# Altium schematic sheet Sinalização.SchDoc
size A4
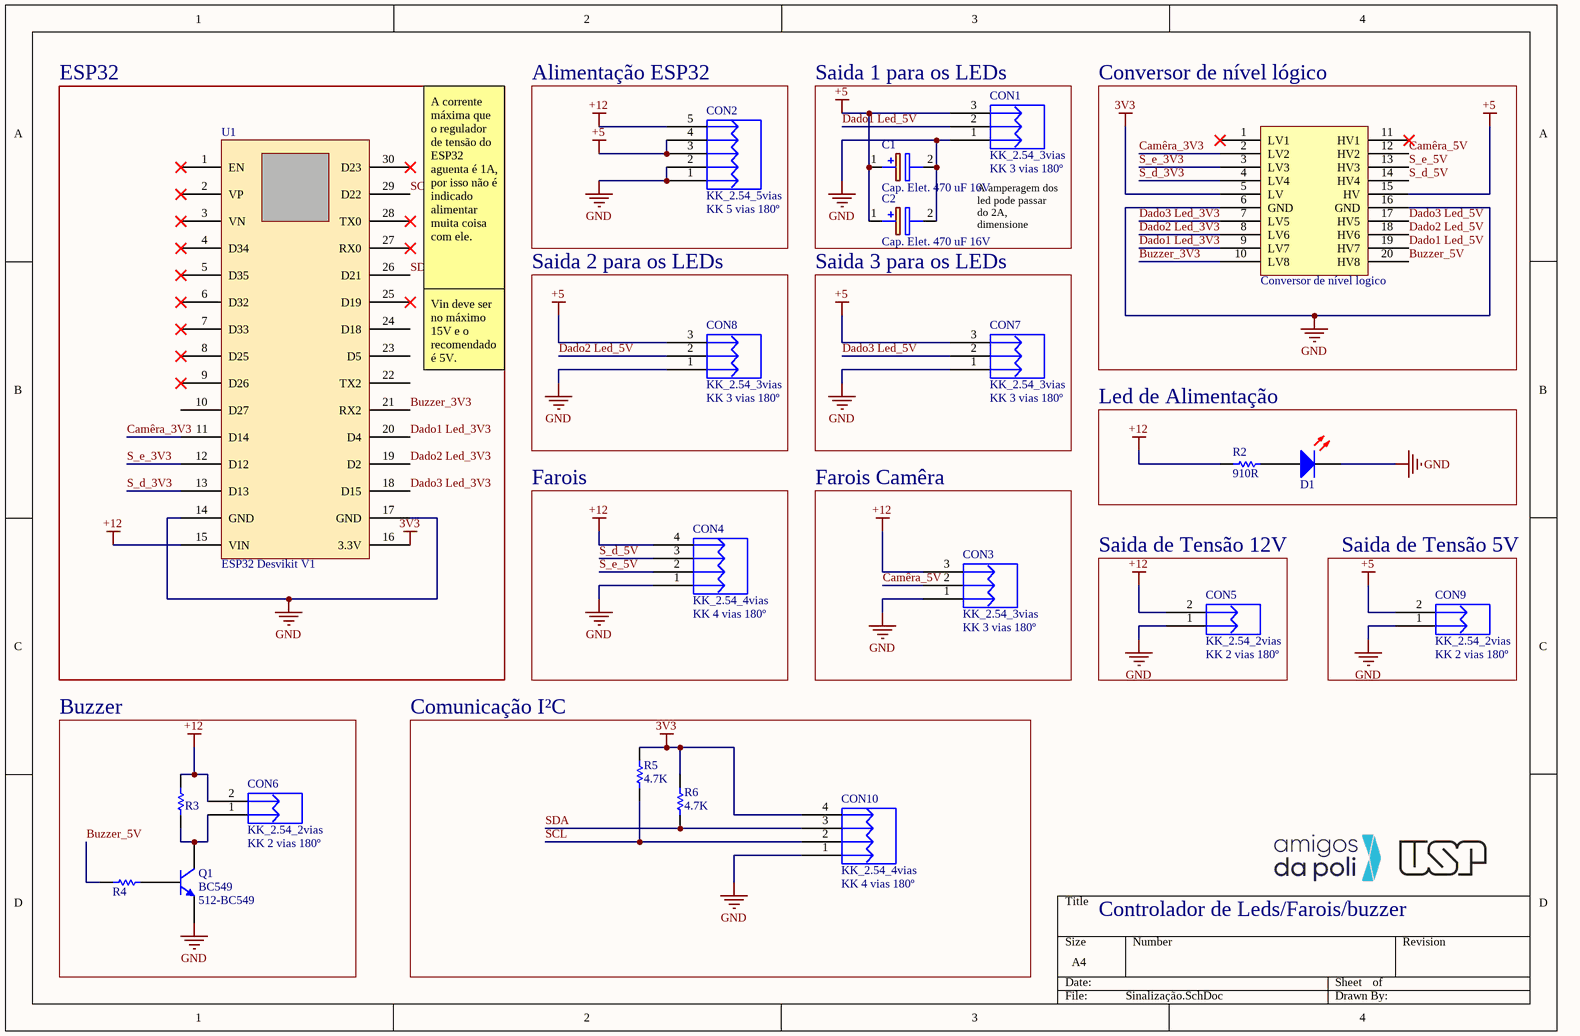
[diagram p0: Sinalização.SchDoc]

## Parts
?  Conversor de nível logico  [Conversor de nível lógico]
C1  Cap. Elet. 470 uF 16V  [Cap. Elet. 470uF 16V]
C2  Cap. Elet. 470 uF 16V  [Cap. Elet. 470uF 16V]
CON1  KK_2.54_3vias  Valor: KK 3 vias 180º  [KK_3vias_180º]
CON2  KK_2.54_5vias  Valor: KK 5 vias 180º  [KK_5vias_180°]
CON3  KK_2.54_3vias  Valor: KK 3 vias 180º  [KK_3vias_180º]
CON4  KK_2.54_4vias  Valor: KK 4 vias 180º  [KK_4vias_180°]
CON5  KK_2.54_2vias  Valor: KK 2 vias 180º  [KK_2VIAS_180º]
CON6  KK_2.54_2vias  Valor: KK 2 vias 180º  [KK_2VIAS_180º]
CON7  KK_2.54_3vias  Valor: KK 3 vias 180º  [KK_3vias_180º]
CON8  KK_2.54_3vias  Valor: KK 3 vias 180º  [KK_3vias_180º]
CON9  KK_2.54_2vias  Valor: KK 2 vias 180º  [KK_2VIAS_180º]
CON10  KK_2.54_4vias  Valor: KK 4 vias 180º  [KK_4vias_180°]
D1  LED 5MM RED  [LED 5MM RED]  (value not drawn)
Q1  BC549  Supplier Part Number 1: 512-BC549  [TO92]
R2  Resistance (Ohms): 910R  [RES 470R 1/4W CARBON FILM]  (hidden comment: RES 470R 1/4W CARBON FILM)
R3  RES 1/4W CARBON FILM  [RES 10K 1/4W CARBON FILM]  (value not drawn)
R4  RES 1/4W CARBON FILM  [RES 10K 1/4W CARBON FILM]  (value not drawn)
R5  4.7K  [RES 4.7K 1/4W CARBON FILM]
R6  4.7K  [RES 4.7K 1/4W CARBON FILM]
U1  value ESP32 Desvikit V1  [ESP32_Desvikit_v1]  (hidden comment: microcontrolador)

## Blocks framed on the sheet
ESP32: U1
Alimentação ESP32: CON2
Saida 1 para os LEDs: C1 C2 CON1
Conversor de nível lógico: ?
Saida 2 para os LEDs: CON8
Saida 3 para os LEDs: CON7
Led de Alimentação: D1 R2
Farois: CON4
Farois Camêra: CON3
Saida de Tensão 12V: CON5
Saida de Tensão 5V: CON9
Buzzer: CON6 Q1 R3 R4
Comunicação I²C: CON10 R5 R6

## Nets
3V3: ?.5(LV) CON10.4 R5.1 R6.1 U1.16(3.3V)
+5: ?.15(HV) C1.1(+) C2.1(+) CON1.3 CON2.3 CON2.4 CON7.3 CON8.3 CON9.2
+12: CON2.5 CON3.3 CON4.4 CON5.2 CON6.2 R2.2 R3.1 U1.15(VIN)
GND: ?.6(GND) ?.16(GND) C1.2(-) C2.2(-) CON1.1 CON2.1 CON2.2 CON3.1 CON4.1 CON5.1 CON7.1 CON8.1 CON9.1 CON10.1 D1.2(K) Q1.3(E) U1.14(GND) U1.17(GND)
Buzzer_3V3: ?.10(LV8) U1.21(RX2)
Buzzer_5V: ?.20(HV8) R4.1
Camêra_3V3: ?.2(LV2) U1.11(D14)
Camêra_5V: ?.12(HV2) CON3.2
Dado1 Led_3V3: ?.9(LV7) U1.20(D4)
Dado1 Led_5V: ?.19(HV7) CON1.2
Dado2 Led_3V3: ?.8(LV6) U1.19(D2)
Dado2 Led_5V: ?.18(HV6) CON8.2
Dado3 Led_3V3: ?.7(LV5) U1.18(D15)
Dado3 Led_5V: ?.17(HV5) CON7.2
S_d_3V3: ?.4(LV4) U1.13(D13)
S_d_5V: ?.14(HV4) CON4.3
S_e_3V3: ?.3(LV3) U1.12(D12)
S_e_5V: ?.13(HV3) CON4.2
SCL: CON10.2 R5.2 U1.29(D22)
SDA: CON10.3 R6.2 U1.26(D21)
NetCON6_1: CON6.1 Q1.1(C) R3.2
NetD1_1: D1.1(A) R2.1
NetQ1_2: Q1.2(B) R4.2

Not connected (* = marked no-connect by the designer): ? 1(LV1)* 11(HV1)*; U1 1(EN)* 2(VP)* 3(VN)* 4(D34)* 5(D35)* 6(D32)* 7(D33)* 8(D25)* 9(D26)* 10(D27) 22(TX2) 23(D5) 24(D18) 25(D19)* 27(RX0)* 28(TX0)* 30(D23)*

## Notes on the sheet
- A amperagem dos led pode passar do 2A, dimensione melhor
- A corrente máxima que o regulador de tensão do  ESP32 aguenta é 1A, por isso não é indicado alimentar muita coisa com ele.
- Vin deve ser no máximo 15V e o recomendado é 5V.
- Controlador de Leds/Farois/buzzer

## Library data of the parts
C1 C2 = Cap. Elet. 470 uF 16V: Aluminum Organic Polymer Capacitors 16volts 470uF ESR 10mohm; Manufacturer_Name: Panasonic; Manufacturer_Part_Number: 16SEPC470M; Datasheet Link: http://industrial.panasonic.com/www-cgi/jvcr13pz.cgi?E+CI+4+AAB8010+16SEPC470M+8+WW; Height: 13mm; Mouser Part Number: 667-16SEPC470M; Mouser Price/Stock: https://www.mouser.co.uk/ProductDetail/Panasonic/16SEPC470M?qs=OE1iw1LrrPEdZuWyF2l%252B5w%3D%3D; Arrow Part Number: 16SEPC470M; Arrow Price/Stock: https://www.arrow.com/en/products/16sepc470m/panasonic
CON1 CON3 CON7 CON8 = KK_2.54_3vias: Conector KK 2.54mm 3 vias; Descrição: Conector KK 3 vias com passo 2.54mm; Encapsulamento: PTH - 180º; Modelo: 3 vias - 180º; Marca: *; Observação: *
CON2 = KK_2.54_5vias: Conector KK 2.54mm 5 vias; Descrição: Conector KK 3 vias com passo 2.54mm; Encapsulamento: PTH - 180º; Modelo: 3 vias - 180º; Marca: *; Observação: *
CON4 CON10 = KK_2.54_4vias: Conector KK 2.54mm 4 vias; Descrição: Conector KK 3 vias com passo 2.54mm; Encapsulamento: PTH - 180º; Modelo: 3 vias - 180º; Marca: *; Observação: *
CON5 CON6 CON9 = KK_2.54_2vias: Conector KK 2.54mm 2 vias; Descrição: Conector KK 3 vias com passo 2.54mm; Encapsulamento: PTH - 180º; Modelo: 2 vias - 180º; Marca: *; Observação: *
D1 = LED 5MM RED: Manufacturer: Paralight; Manufacturer Part Number: IMP585; Bulb Size: 3mm; Wavelength Typ: 625; Forward Voltage: 2; Forward Current If: 20; Luminous Intensity: 3; LED Mounting: Through Hole; Lens Shape: Round; Viewing Angle: 60°; SVHC: No SVHC (15-Jun-2015); External Diameter: 2.9; External Length / Height: 4.6; Forward Voltage VF Max: 2.5; LED / Lamp Size: 3mm / T-1; LED Type: Standard; Lead Cross-section Depth: 0.5; Luminous Intensity @ If Min: 0.7; PIV Max: 5; Peak Forward Current: 7; Voltage Vf Typ: 2.2V<!--FANDB--><div class="features-and-benefits-container"><div class="features-and-benefits-description"><span class="features-benefits-value">The L-934LID from Kingbright is a through hole round shape high efficiency red colour LED. The device is made of gallium arsenide phosphide on gallium phosphide orange light emitting diode. This LED is widely used because of low power consumption, long life and solid state reliability.</span></div><div class="features-and-benefits-list"><ul class="features-and-benefits-list-list"><li class="features-and-benefits-list-item">Standard bulb size of T-1 (3mm)</li><li class="features-and-benefits-list-item">Reliable and rugged</li><li class="features-and-benefits-list-item">Viewing angle is 60°</li><li class="features-and-benefits-list-item">Luminous intensity of 3mcd at 2mA</li><li class="features-and-benefits-list-item">Forward voltage is 2.0V</li><li class="features-and-benefits-list-item">Forward current (If) is 20mA</li><li class="features-and-benefits-list-item">Dominant wavelength is 625nm at IF=20mA</li><li class="features-and-benefits-list-item">Peak wavelength is 627nm at IF=20; Supplier 1: Mult Comercial; RoHS: YES; Stock 1: 35260; Pricing 1: 1=0.15 (BRL); LED Colour: Red; Packaging: Each; MSL: -; Current If Luminous Intensity: 2; Dominant Wavelength: 625; Forward Current If Max: 20; Lead Cross-section Width: 0.5; Lead Spacing: 2.54; Luminous Intensity Typ: 3; Mounting Type: PCB Through Hole; No. of Pins: 2; Operating Temperature Max: 85; Operating Temperature Min: -40; Operating Temperature Range: -40°C to +85; Peak Wavelength: 625; ComponentLink1URL: http://loja.multcomercial.com.br/led-3mm-vermelho-difuso-l-314hd-paralight.html; ComponentLink1Description: http://loja.multcomercial.com.br/led-3mm-vermelho-difuso-l-314hd-paralight.html; Supplier Part Number 1: Led 3mm Vermelho Difuso L-314HD - Paralight
Q1 = BC549: TRANS NPN 30V 0.1A TO-92; Manufacturer: Fairchild Semiconductor; Configuration: Single; Emitter- Base Voltage VEBO: 5 V; Collector-Emitter Saturation Voltage: 200 mV; Gain Bandwidth Product fT: 300 MHz; DC Collector/Base Gain hfe Min: 110; DC Current Gain hFE Max: 800; Maximum Power Dissipation: 0.5 W; Supplier 1: Mouser; Manufacturer Part Number: BC549; Product Category: Bipolar Transistors - BJT; RoHS: Details; Transistor Polarity: NPN; Collector- Base Voltage VCBO: 30 V; Collector- Emitter Voltage VCEO Max: 30 V; Maximum DC Collector Current: 0.1 A; Maximum Operating Temperature: + 150 C; Mounting Style: Through Hole; Package / Case: TO-92-3; Brand: Fairchild Semiconductor; Minimum Operating Temperature: - 65 C; Packaging: Bulk; Series: BC549; Factory Pack Quantity: 2000; ComponentLink1URL: https://datasheet.ciiva.com/982/bc546-982130.pdf; ComponentLink1Description: https://datasheet.ciiva.com/982/bc546-982130.pdf; ComponentLink2URL: https://datasheet.ciiva.com/17179/bc549-17179663.pdf; ComponentLink2Description: https://datasheet.ciiva.com/17179/bc549-17179663.pdf
R2 = RES 470R 1/4W CARBON FILM: RES 470R OHM 1/4W 5% CARBON FILM; Manufacturer: Ty-Ohm; Manufacturer Part Number: CR25; Power (Watts): 0.25W, 1/4W; Temperature Coefficient: 0/ -500ppm/°C; Supplier 1: Mult Comercial; RoHS: RoHS Compliant; Category: Resistors; Stock 1: 617543; Pricing 1: 1=0.20 (BRL); Packaging: Cut Tape (CT); Tolerance: ±5%; Composition: Carbon Film; Features: Flame Retardant Coating, Safety; Operating Temperature: -55°C ~ 155°C; Package / Case: Axial; Supplier Device Package: Axial; Size / Dimension: 0.091" Dia x 0.256" L (2.30mm x 6.50mm); Height: -; Number of Terminations: 2; ComponentLink1URL: http://loja.multcomercial.com.br/resistor-de-1-4-de-watt-cr25-5-de-tolerancia.html; ComponentLink1Description: http://loja.multcomercial.com.br/resistor-de-1-4-de-watt-cr25-5-de-tolerancia.html; Supplier Part Number 1: Resistor de Filme de Carbono 1/4 de Watt CR25 5% de tolerância - 0.22R Ω à 10M Ω
R3 R4 = RES 1/4W CARBON FILM: RES ? OHM 1/4W 5% CARBON FILM; Manufacturer: Ty-Ohm; Manufacturer Part Number: CR25; Power (Watts): 0.25W, 1/4W; Temperature Coefficient: 0/ -500ppm/°C; Supplier 1: Mult Comercial; RoHS: RoHS Compliant; Category: Resistors; Stock 1: 617543; Pricing 1: 1=0.20 (BRL); Packaging: Cut Tape (CT); Tolerance: ±5%; Composition: Carbon Film; Features: Flame Retardant Coating, Safety; Operating Temperature: -55°C ~ 155°C; Package / Case: Axial; Supplier Device Package: Axial; Size / Dimension: 0.091" Dia x 0.256" L (2.30mm x 6.50mm); Height: -; Number of Terminations: 2; ComponentLink1URL: http://loja.multcomercial.com.br/resistor-de-1-4-de-watt-cr25-5-de-tolerancia.html; ComponentLink1Description: http://loja.multcomercial.com.br/resistor-de-1-4-de-watt-cr25-5-de-tolerancia.html; Supplier Part Number 1: Resistor de Filme de Carbono 1/4 de Watt CR25 5% de tolerância - 0.22R Ω à 10M Ω; Resistance (Ohms): ?
R5 R6 = RES 4.7K 1/4W CARBON FILM: RES 4.7K OHM 1/4W 5% CARBON FILM; Manufacturer: Ty-Ohm; Manufacturer Part Number: CR25; Power (Watts): 0.25W, 1/4W; Temperature Coefficient: 0/ -500ppm/°C; Supplier 1: Mult Comercial; RoHS: RoHS Compliant; Category: Resistors; Stock 1: 617543; Pricing 1: 1=0.20 (BRL); Packaging: Cut Tape (CT); Tolerance: ±5%; Composition: Carbon Film; Features: Flame Retardant Coating, Safety; Operating Temperature: -55°C ~ 155°C; Package / Case: Axial; Supplier Device Package: Axial; Size / Dimension: 0.091" Dia x 0.256" L (2.30mm x 6.50mm); Height: -; Number of Terminations: 2; ComponentLink1URL: http://loja.multcomercial.com.br/resistor-de-1-4-de-watt-cr25-5-de-tolerancia.html; ComponentLink1Description: http://loja.multcomercial.com.br/resistor-de-1-4-de-watt-cr25-5-de-tolerancia.html; Supplier Part Number 1: Resistor de Filme de Carbono 1/4 de Watt CR25 5% de tolerância - 0.22R Ω à 10M Ω; Resistance (Ohms): ?
U1 = ESP32 Desvikit v1: microcontrolador com moculo bluethoth e wifi